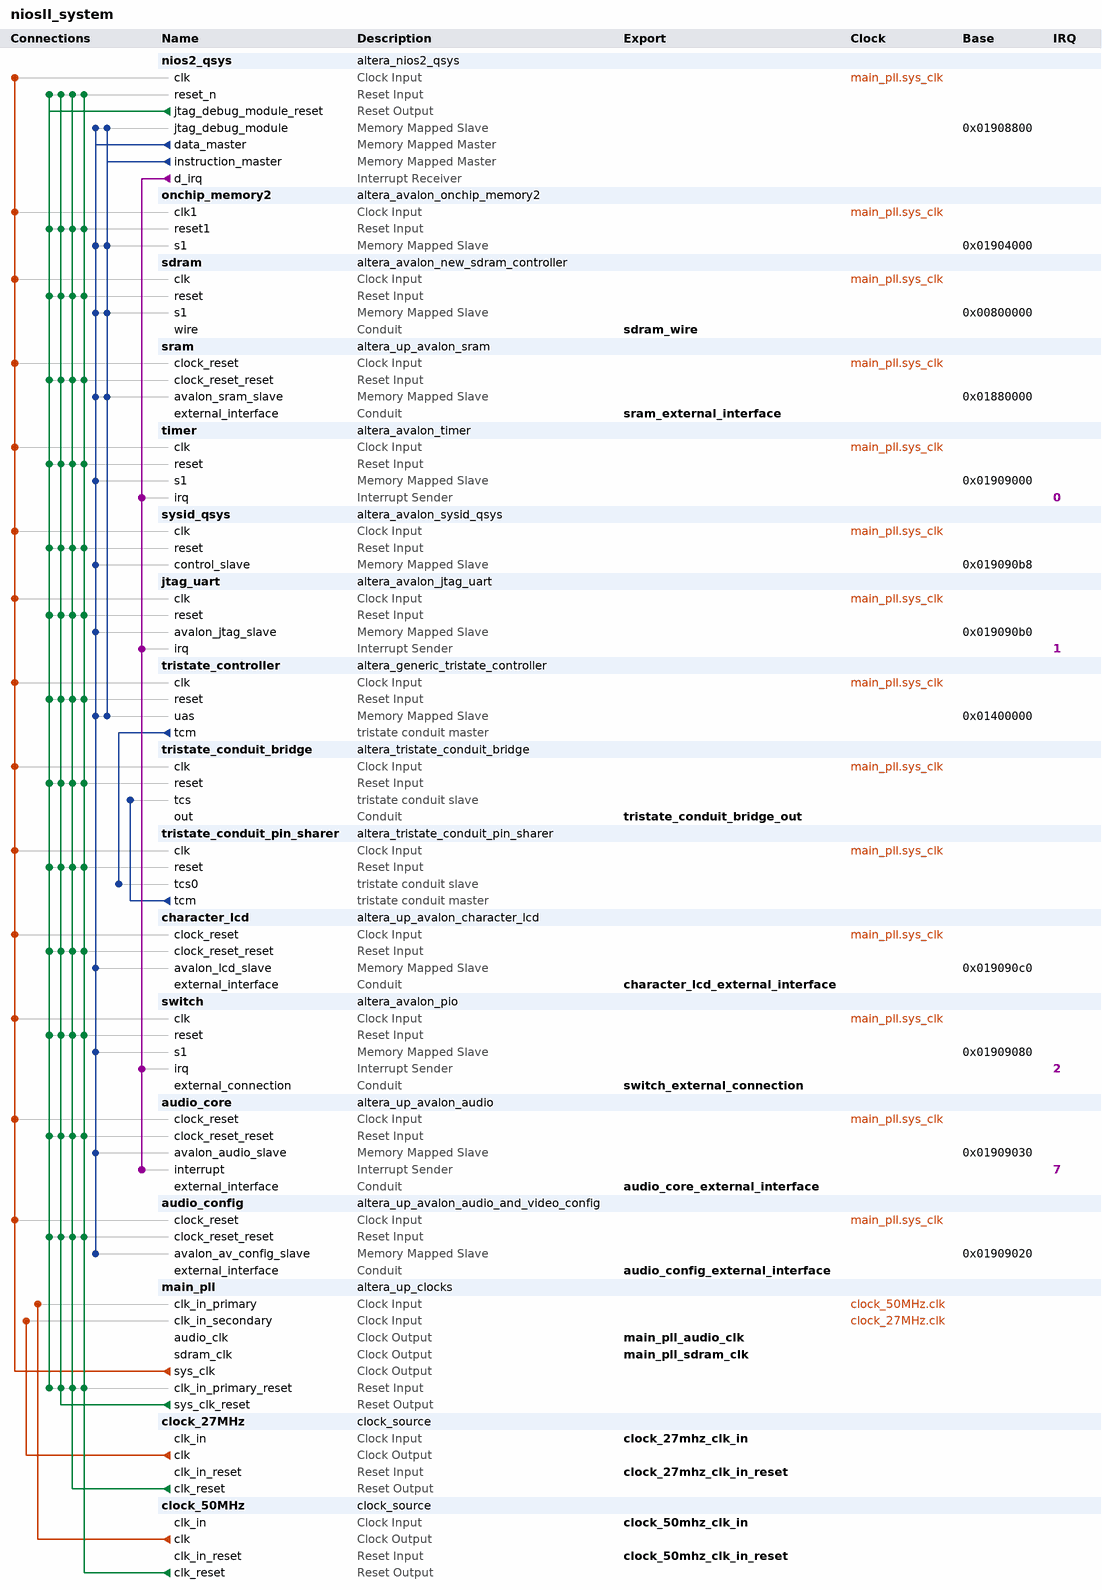
[diagram p0: system contents]
# Platform Designer (Qsys) system niosII_system, Cyclone II EP2C35F672C6
# Parameters at their usual value, and those the tool derives, are not listed.
package require -exact qsys 12.1
create_system niosII_system
set_project_property DEVICE_FAMILY {Cyclone II}
set_project_property DEVICE EP2C35F672C6

add_instance nios2_qsys altera_nios2_qsys 12.1
set_instance_parameter_value nios2_qsys resetSlave onchip_memory2.s1
set_instance_parameter_value nios2_qsys exceptionSlave onchip_memory2.s1
set_instance_parameter_value nios2_qsys breakSlave nios2_qsys.jtag_debug_module
set_instance_parameter_value nios2_qsys impl Fast
set_instance_parameter_value nios2_qsys icache_size 8192
set_instance_parameter_value nios2_qsys icache_burstType Sequential
set_instance_parameter_value nios2_qsys dcache_bursts true
set_instance_parameter_value nios2_qsys dcache_size 8192

add_instance onchip_memory2 altera_avalon_onchip_memory2 12.1
set_instance_parameter_value onchip_memory2 dataWidth 32
set_instance_parameter_value onchip_memory2 dualPort false
set_instance_parameter_value onchip_memory2 initMemContent true
set_instance_parameter_value onchip_memory2 initializationFileName onchip_memory2
set_instance_parameter_value onchip_memory2 memorySize 16384

add_instance sdram altera_avalon_new_sdram_controller 12.1
set_instance_parameter_value sdram TAC 5.5
set_instance_parameter_value sdram TRCD 20.0
set_instance_parameter_value sdram TRP 20.0
set_instance_parameter_value sdram casLatency 3
set_instance_parameter_value sdram columnWidth 8
set_instance_parameter_value sdram dataWidth 16
set_instance_parameter_value sdram generateSimulationModel false
set_instance_parameter_value sdram model custom
set_instance_parameter_value sdram numberOfBanks 4
set_instance_parameter_value sdram numberOfChipSelects 1
set_instance_parameter_value sdram powerUpDelay 100.0
set_instance_parameter_value sdram refreshPeriod 15.625
set_instance_parameter_value sdram rowWidth 12

add_instance sram altera_up_avalon_sram 12.0
set_instance_parameter_value sram board DE2
set_instance_parameter_value sram pixel_buffer false

add_instance timer altera_avalon_timer 12.1
set_instance_parameter_value timer period 1
set_instance_parameter_value timer periodUnits MSEC
set_instance_parameter_value timer timerPreset CUSTOM

add_instance sysid_qsys altera_avalon_sysid_qsys 12.1
set_instance_parameter_value sysid_qsys id 0

add_instance jtag_uart altera_avalon_jtag_uart 12.1
set_instance_parameter_value jtag_uart simInteractiveOptions INTERACTIVE_INPUT_OUTPUT

add_instance tristate_controller altera_generic_tristate_controller 12.1
set_instance_parameter_value tristate_controller TCM_ADDRESS_W 22
set_instance_parameter_value tristate_controller TCM_DATA_W 8
set_instance_parameter_value tristate_controller TCM_BYTEENABLE_W 1
set_instance_parameter_value tristate_controller TCM_READ_WAIT 160
set_instance_parameter_value tristate_controller TCM_WRITE_WAIT 160
set_instance_parameter_value tristate_controller TCM_SETUP_WAIT 40
set_instance_parameter_value tristate_controller TCM_DATA_HOLD 40
set_instance_parameter_value tristate_controller TCM_MAX_PENDING_READ_TRANSACTIONS 3
set_instance_parameter_value tristate_controller TCM_TURNAROUND_TIME 2
set_instance_parameter_value tristate_controller TCM_TIMING_UNITS 0
set_instance_parameter_value tristate_controller TCM_READLATENCY 2
set_instance_parameter_value tristate_controller TCM_SYMBOLS_PER_WORD 1
set_instance_parameter_value tristate_controller USE_READ 1
set_instance_parameter_value tristate_controller USE_BEGINTRANSFER 1
set_instance_parameter_value tristate_controller USE_BYTEENABLE 1
set_instance_parameter_value tristate_controller USE_OUTPUTENABLE 0
set_instance_parameter_value tristate_controller ACTIVE_LOW_READ 1
set_instance_parameter_value tristate_controller ACTIVE_LOW_BYTEENABLE 0
set_instance_parameter_value tristate_controller ACTIVE_LOW_OUTPUTENABLE 0
set_instance_parameter_value tristate_controller ACTIVE_LOW_BEGINTRANSFER 0
set_instance_parameter_value tristate_controller CHIPSELECT_THROUGH_READLATENCY 0
set_instance_parameter_value tristate_controller MODULE_ASSIGNMENT_KEYS embeddedsw.configuration.hwClassnameDriverSupportList,embeddedsw.configuration.isFlash,embeddedsw.configuration.isMemoryDevice,embeddedsw.configuration.isNonVolatileStorage
set_instance_parameter_value tristate_controller MODULE_ASSIGNMENT_VALUES "altera_avalon_lan91c111\\,altera_avalon_cfi_flash,1,1,1"
set_instance_parameter_value tristate_controller INTERFACE_ASSIGNMENT_KEYS embeddedsw.configuration.isFlash,embeddedsw.configuration.isMemoryDevice,embeddedsw.configuration.isNonVolatileStorage
set_instance_parameter_value tristate_controller INTERFACE_ASSIGNMENT_VALUES 1,1,1

add_instance tristate_conduit_bridge altera_tristate_conduit_bridge 12.1

add_instance tristate_conduit_pin_sharer altera_tristate_conduit_pin_sharer 12.1
set_instance_parameter_value tristate_conduit_pin_sharer NUM_INTERFACES 1
set_instance_parameter_value tristate_conduit_pin_sharer MODULE_ORIGIN_LIST tristate_controller.tcm,tristate_controller.tcm,tristate_controller.tcm,tristate_controller.tcm,tristate_controller.tcm,tristate_controller.tcm,tristate_controller.tcm
set_instance_parameter_value tristate_conduit_pin_sharer SIGNAL_ORIGIN_LIST byteenable,address,read_n,write_n,data,chipselect_n,begintransfer

add_instance character_lcd altera_up_avalon_character_lcd 12.0
set_instance_parameter_value character_lcd cursor Normal

add_instance switch altera_avalon_pio 12.1
set_instance_parameter_value switch captureEdge true
set_instance_parameter_value switch direction Input
set_instance_parameter_value switch edgeType ANY
set_instance_parameter_value switch generateIRQ true
set_instance_parameter_value switch irqType EDGE
set_instance_parameter_value switch width 1

add_instance audio_core altera_up_avalon_audio 12.0
set_instance_parameter_value audio_core avalon_bus_type {Memory Mapped}
set_instance_parameter_value audio_core audio_in true
set_instance_parameter_value audio_core dw 32

add_instance audio_config altera_up_avalon_audio_and_video_config 12.0
set_instance_parameter_value audio_config board DE2
set_instance_parameter_value audio_config audio_in {Microphone to ADC}
set_instance_parameter_value audio_config line_in_bypass false
set_instance_parameter_value audio_config bit_length 16
set_instance_parameter_value audio_config sampling_rate {32 kHz}

add_instance main_pll altera_up_clocks 12.0
set_instance_parameter_value main_pll board DE2
set_instance_parameter_value main_pll vga_clk false
set_instance_parameter_value main_pll audio_clk true
set_instance_parameter_value main_pll audio_clk_freq 12.288

add_instance clock_27MHz clock_source 12.1
set_instance_parameter_value clock_27MHz clockFrequency 27000000

add_instance clock_50MHz clock_source 12.1
set_instance_parameter_value clock_50MHz clockFrequency 50000000

# connections
add_connection clock_27MHz.clk main_pll.clk_in_secondary clock
add_connection clock_50MHz.clk main_pll.clk_in_primary clock
add_connection main_pll.sys_clk audio_config.clock_reset clock
add_connection main_pll.sys_clk audio_core.clock_reset clock
add_connection main_pll.sys_clk character_lcd.clock_reset clock
add_connection main_pll.sys_clk jtag_uart.clk clock
add_connection main_pll.sys_clk nios2_qsys.clk clock
add_connection main_pll.sys_clk onchip_memory2.clk1 clock
add_connection main_pll.sys_clk sdram.clk clock
add_connection main_pll.sys_clk sram.clock_reset clock
add_connection main_pll.sys_clk switch.clk clock
add_connection main_pll.sys_clk sysid_qsys.clk clock
add_connection main_pll.sys_clk timer.clk clock
add_connection main_pll.sys_clk tristate_conduit_bridge.clk clock
add_connection main_pll.sys_clk tristate_conduit_pin_sharer.clk clock
add_connection main_pll.sys_clk tristate_controller.clk clock
add_connection clock_27MHz.clk_reset audio_config.clock_reset_reset reset
add_connection clock_27MHz.clk_reset audio_core.clock_reset_reset reset
add_connection clock_27MHz.clk_reset character_lcd.clock_reset_reset reset
add_connection clock_27MHz.clk_reset jtag_uart.reset reset
add_connection clock_27MHz.clk_reset main_pll.clk_in_primary_reset reset
add_connection clock_27MHz.clk_reset nios2_qsys.reset_n reset
add_connection clock_27MHz.clk_reset onchip_memory2.reset1 reset
add_connection clock_27MHz.clk_reset sdram.reset reset
add_connection clock_27MHz.clk_reset sram.clock_reset_reset reset
add_connection clock_27MHz.clk_reset switch.reset reset
add_connection clock_27MHz.clk_reset sysid_qsys.reset reset
add_connection clock_27MHz.clk_reset timer.reset reset
add_connection clock_27MHz.clk_reset tristate_conduit_bridge.reset reset
add_connection clock_27MHz.clk_reset tristate_conduit_pin_sharer.reset reset
add_connection clock_27MHz.clk_reset tristate_controller.reset reset
add_connection clock_50MHz.clk_reset audio_config.clock_reset_reset reset
add_connection clock_50MHz.clk_reset audio_core.clock_reset_reset reset
add_connection clock_50MHz.clk_reset character_lcd.clock_reset_reset reset
add_connection clock_50MHz.clk_reset jtag_uart.reset reset
add_connection clock_50MHz.clk_reset main_pll.clk_in_primary_reset reset
add_connection clock_50MHz.clk_reset nios2_qsys.reset_n reset
add_connection clock_50MHz.clk_reset onchip_memory2.reset1 reset
add_connection clock_50MHz.clk_reset sdram.reset reset
add_connection clock_50MHz.clk_reset sram.clock_reset_reset reset
add_connection clock_50MHz.clk_reset switch.reset reset
add_connection clock_50MHz.clk_reset sysid_qsys.reset reset
add_connection clock_50MHz.clk_reset timer.reset reset
add_connection clock_50MHz.clk_reset tristate_conduit_bridge.reset reset
add_connection clock_50MHz.clk_reset tristate_conduit_pin_sharer.reset reset
add_connection clock_50MHz.clk_reset tristate_controller.reset reset
add_connection main_pll.sys_clk_reset audio_config.clock_reset_reset reset
add_connection main_pll.sys_clk_reset audio_core.clock_reset_reset reset
add_connection main_pll.sys_clk_reset character_lcd.clock_reset_reset reset
add_connection main_pll.sys_clk_reset jtag_uart.reset reset
add_connection main_pll.sys_clk_reset main_pll.clk_in_primary_reset reset
add_connection main_pll.sys_clk_reset nios2_qsys.reset_n reset
add_connection main_pll.sys_clk_reset onchip_memory2.reset1 reset
add_connection main_pll.sys_clk_reset sdram.reset reset
add_connection main_pll.sys_clk_reset sram.clock_reset_reset reset
add_connection main_pll.sys_clk_reset switch.reset reset
add_connection main_pll.sys_clk_reset sysid_qsys.reset reset
add_connection main_pll.sys_clk_reset timer.reset reset
add_connection main_pll.sys_clk_reset tristate_conduit_bridge.reset reset
add_connection main_pll.sys_clk_reset tristate_conduit_pin_sharer.reset reset
add_connection main_pll.sys_clk_reset tristate_controller.reset reset
add_connection nios2_qsys.jtag_debug_module_reset audio_config.clock_reset_reset reset
add_connection nios2_qsys.jtag_debug_module_reset audio_core.clock_reset_reset reset
add_connection nios2_qsys.jtag_debug_module_reset character_lcd.clock_reset_reset reset
add_connection nios2_qsys.jtag_debug_module_reset jtag_uart.reset reset
add_connection nios2_qsys.jtag_debug_module_reset main_pll.clk_in_primary_reset reset
add_connection nios2_qsys.jtag_debug_module_reset nios2_qsys.reset_n reset
add_connection nios2_qsys.jtag_debug_module_reset onchip_memory2.reset1 reset
add_connection nios2_qsys.jtag_debug_module_reset sdram.reset reset
add_connection nios2_qsys.jtag_debug_module_reset sram.clock_reset_reset reset
add_connection nios2_qsys.jtag_debug_module_reset switch.reset reset
add_connection nios2_qsys.jtag_debug_module_reset sysid_qsys.reset reset
add_connection nios2_qsys.jtag_debug_module_reset timer.reset reset
add_connection nios2_qsys.jtag_debug_module_reset tristate_conduit_bridge.reset reset
add_connection nios2_qsys.jtag_debug_module_reset tristate_conduit_pin_sharer.reset reset
add_connection nios2_qsys.jtag_debug_module_reset tristate_controller.reset reset
add_connection nios2_qsys.data_master audio_config.avalon_av_config_slave avalon
set_connection_parameter_value nios2_qsys.data_master/audio_config.avalon_av_config_slave baseAddress 0x01909020
add_connection nios2_qsys.data_master audio_core.avalon_audio_slave avalon
set_connection_parameter_value nios2_qsys.data_master/audio_core.avalon_audio_slave baseAddress 0x01909030
add_connection nios2_qsys.data_master character_lcd.avalon_lcd_slave avalon
set_connection_parameter_value nios2_qsys.data_master/character_lcd.avalon_lcd_slave baseAddress 0x019090c0
add_connection nios2_qsys.data_master jtag_uart.avalon_jtag_slave avalon
set_connection_parameter_value nios2_qsys.data_master/jtag_uart.avalon_jtag_slave baseAddress 0x019090b0
add_connection nios2_qsys.data_master nios2_qsys.jtag_debug_module avalon
set_connection_parameter_value nios2_qsys.data_master/nios2_qsys.jtag_debug_module baseAddress 0x01908800
add_connection nios2_qsys.data_master onchip_memory2.s1 avalon
set_connection_parameter_value nios2_qsys.data_master/onchip_memory2.s1 baseAddress 0x01904000
add_connection nios2_qsys.data_master sdram.s1 avalon
set_connection_parameter_value nios2_qsys.data_master/sdram.s1 baseAddress 0x00800000
add_connection nios2_qsys.data_master sram.avalon_sram_slave avalon
set_connection_parameter_value nios2_qsys.data_master/sram.avalon_sram_slave baseAddress 0x01880000
add_connection nios2_qsys.data_master switch.s1 avalon
set_connection_parameter_value nios2_qsys.data_master/switch.s1 baseAddress 0x01909080
add_connection nios2_qsys.data_master sysid_qsys.control_slave avalon
set_connection_parameter_value nios2_qsys.data_master/sysid_qsys.control_slave baseAddress 0x019090b8
add_connection nios2_qsys.data_master timer.s1 avalon
set_connection_parameter_value nios2_qsys.data_master/timer.s1 baseAddress 0x01909000
add_connection nios2_qsys.data_master tristate_controller.uas avalon
set_connection_parameter_value nios2_qsys.data_master/tristate_controller.uas baseAddress 0x01400000
add_connection nios2_qsys.instruction_master nios2_qsys.jtag_debug_module avalon
set_connection_parameter_value nios2_qsys.instruction_master/nios2_qsys.jtag_debug_module baseAddress 0x01908800
add_connection nios2_qsys.instruction_master onchip_memory2.s1 avalon
set_connection_parameter_value nios2_qsys.instruction_master/onchip_memory2.s1 baseAddress 0x01904000
add_connection nios2_qsys.instruction_master sdram.s1 avalon
set_connection_parameter_value nios2_qsys.instruction_master/sdram.s1 baseAddress 0x00800000
add_connection nios2_qsys.instruction_master sram.avalon_sram_slave avalon
set_connection_parameter_value nios2_qsys.instruction_master/sram.avalon_sram_slave baseAddress 0x01880000
add_connection nios2_qsys.instruction_master tristate_controller.uas avalon
set_connection_parameter_value nios2_qsys.instruction_master/tristate_controller.uas baseAddress 0x01400000
add_connection nios2_qsys.d_irq audio_core.interrupt interrupt
set_connection_parameter_value nios2_qsys.d_irq/audio_core.interrupt irqNumber 7
add_connection nios2_qsys.d_irq jtag_uart.irq interrupt
set_connection_parameter_value nios2_qsys.d_irq/jtag_uart.irq irqNumber 1
add_connection nios2_qsys.d_irq switch.irq interrupt
set_connection_parameter_value nios2_qsys.d_irq/switch.irq irqNumber 2
add_connection nios2_qsys.d_irq timer.irq interrupt
set_connection_parameter_value nios2_qsys.d_irq/timer.irq irqNumber 0
add_connection tristate_conduit_pin_sharer.tcm tristate_conduit_bridge.tcs tristate_conduit
add_connection tristate_controller.tcm tristate_conduit_pin_sharer.tcs0 tristate_conduit

# exported interfaces
add_interface switch_external_connection conduit end
set_interface_property switch_external_connection EXPORT_OF switch.external_connection
add_interface sdram_wire conduit end
set_interface_property sdram_wire EXPORT_OF sdram.wire
add_interface sram_external_interface conduit end
set_interface_property sram_external_interface EXPORT_OF sram.external_interface
add_interface character_lcd_external_interface conduit end
set_interface_property character_lcd_external_interface EXPORT_OF character_lcd.external_interface
add_interface audio_core_external_interface conduit end
set_interface_property audio_core_external_interface EXPORT_OF audio_core.external_interface
add_interface audio_config_external_interface conduit end
set_interface_property audio_config_external_interface EXPORT_OF audio_config.external_interface
add_interface tristate_conduit_bridge_out conduit end
set_interface_property tristate_conduit_bridge_out EXPORT_OF tristate_conduit_bridge.out
add_interface main_pll_sdram_clk clock source
set_interface_property main_pll_sdram_clk EXPORT_OF main_pll.sdram_clk
add_interface clock_27mhz_clk_in clock sink
set_interface_property clock_27mhz_clk_in EXPORT_OF clock_27MHz.clk_in
add_interface clock_27mhz_clk_in_reset reset sink
set_interface_property clock_27mhz_clk_in_reset EXPORT_OF clock_27MHz.clk_in_reset
add_interface main_pll_audio_clk clock source
set_interface_property main_pll_audio_clk EXPORT_OF main_pll.audio_clk
add_interface clock_50mhz_clk_in clock sink
set_interface_property clock_50mhz_clk_in EXPORT_OF clock_50MHz.clk_in
add_interface clock_50mhz_clk_in_reset reset sink
set_interface_property clock_50mhz_clk_in_reset EXPORT_OF clock_50MHz.clk_in_reset

save_system niosII_system.qsys
